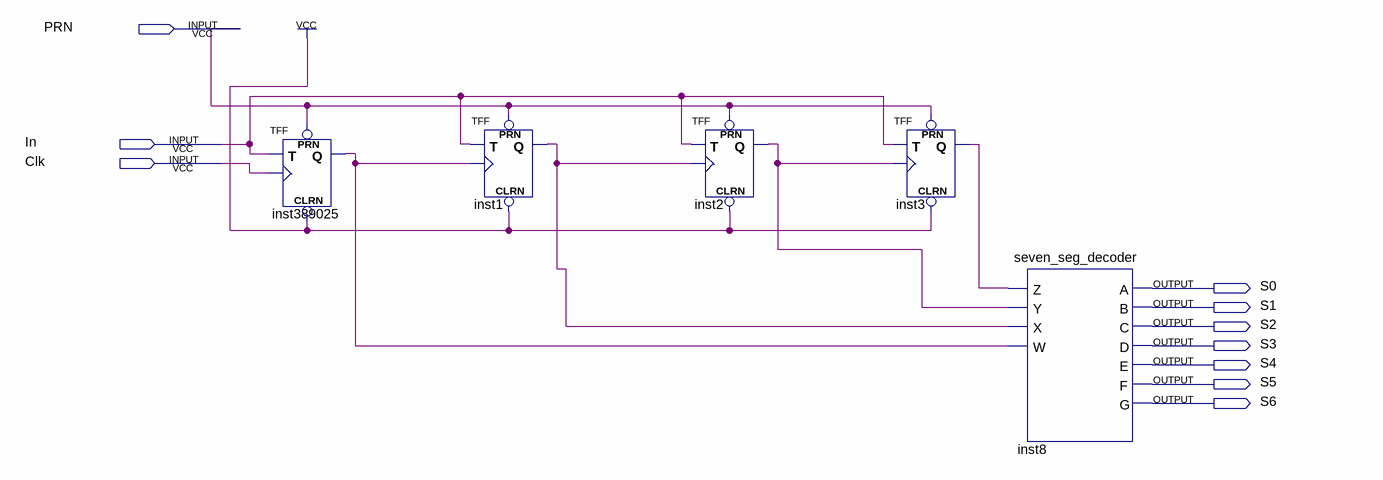
[diagram p0: schematic sheet]
// Quartus schematic lab10step3b.bdf as structural Verilog: 5 symbols, 10 pins
module lab10step3b (
  input  PRN,
  input  In,
  input  Clk,
  output S0,
  output S1,
  output S2,
  output S3,
  output S4,
  output S5,
  output S6
);

  wire inst1_q, inst2_q, inst3_q, inst389025_q;

  TFF inst389025 (.PRN(PRN), .CLRN(1'b1), .T(In), .CLK(Clk), .Q(inst389025_q));
  TFF inst1 (.PRN(PRN), .CLRN(1'b1), .T(In), .CLK(inst389025_q), .Q(inst1_q));
  TFF inst2 (.PRN(PRN), .CLRN(1'b1), .T(In), .CLK(inst1_q), .Q(inst2_q));
  TFF inst3 (.PRN(PRN), .CLRN(1'b1), .T(In), .CLK(inst2_q), .Q(inst3_q));
  seven_seg_decoder inst8 (
    .Z(inst3_q), .Y(inst2_q), .X(inst1_q), .W(inst389025_q), .A(S0), .B(S1), .C(S2), .D(S3), .E(S4), .F(S5),
    .G(S6));
endmodule
